# Altium schematic sheet Clocks.SchDoc
size A4
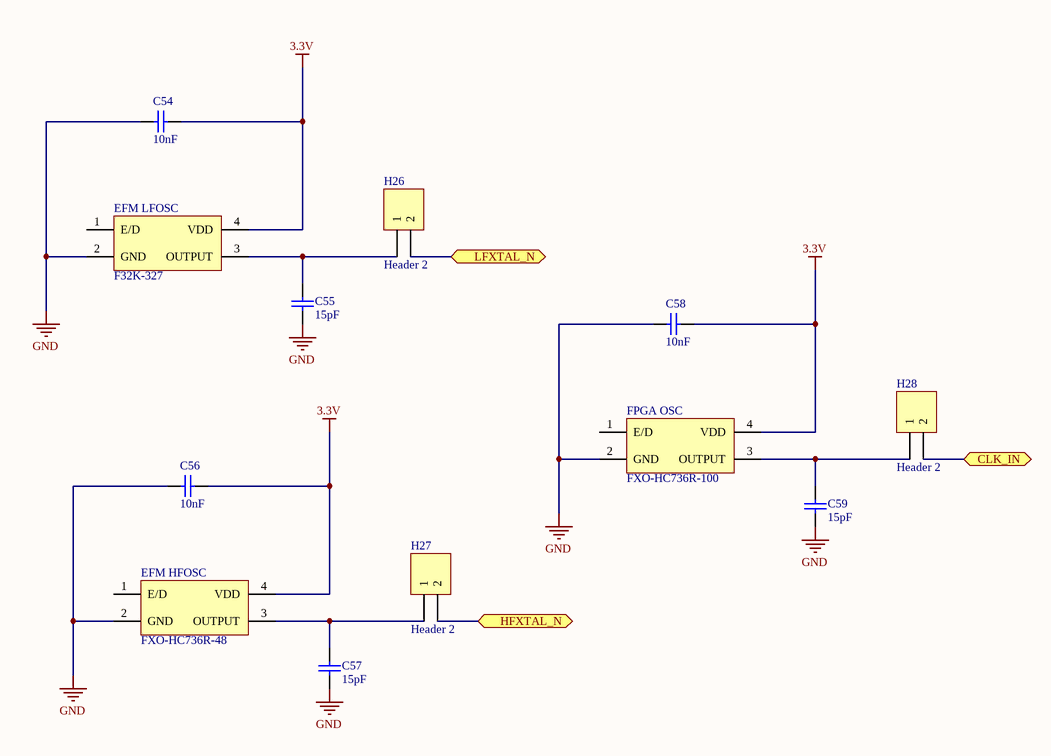
[diagram p0: Clocks.SchDoc]

## Parts
C54  10nF  [CAPC0603(1608)100_M]
C55  15pF  [CAPC0603(1608)100_M]
C56  10nF  [CAPC0603(1608)100_M]
C57  15pF  [CAPC0603(1608)100_M]
C58  10nF  [CAPC0603(1608)100_M]
C59  15pF  [CAPC0603(1608)100_M]
EFM_HFOSC  FXO-HC736R-48  [FPGA-OSC]
EFM_LFOSC  F32K-327  [LFOSC-32]
FPGA_OSC  FXO-HC736R-100  [FPGA-OSC]
H26  Header 2  [HDR1X2]
H27  Header 2  [HDR1X2]
H28  Header 2  [HDR1X2]

## Ports
CLK_IN, HFXTAL_N, LFXTAL_N

## Nets
3.3V: C54.2 C56.2 C58.2 EFM_HFOSC.4(VDD) EFM_LFOSC.4(VDD) FPGA_OSC.4(VDD)
GND: C54.1 C55.1 C56.1 C57.1 C58.1 C59.1 EFM_HFOSC.2(GND) EFM_LFOSC.2(GND) FPGA_OSC.2(GND)
CLK_IN: H28.2 ; port CLK_IN
HFXTAL_N: H27.2 ; port HFXTAL_N
LFXTAL_N: H26.2 ; port LFXTAL_N
NetC55_2: C55.2 EFM_LFOSC.3(OUTPUT) H26.1
NetC57_2: C57.2 EFM_HFOSC.3(OUTPUT) H27.1
NetC59_2: C59.2 FPGA_OSC.3(OUTPUT) H28.1

Not connected (* = marked no-connect by the designer): EFM_HFOSC 1(E/D); EFM_LFOSC 1(E/D); FPGA_OSC 1(E/D)

## Library data of the parts
C54-C59 = CMP-1035-00001-1: CAP 0.5pF 10V Â±0.1pF 0603 (1608 Metric) Thickness 1mm SMD; Case-EIA: 0603; Case-Metric: 1608; Max Thickness: 1 mm; Tolerance: Â±0.1pF; Technology: SMT; Rated Voltage: 10 V
  C54 C56 C58: Value: 10nF
  C55 C57 C59: Value: 15pF
H26-H28 = Header 2: Header, 2-Pin; LatestRevisionDate: 17-Jul-2002; LatestRevisionNote: Re-released for DXP Platform.; Publisher: Altium Limited